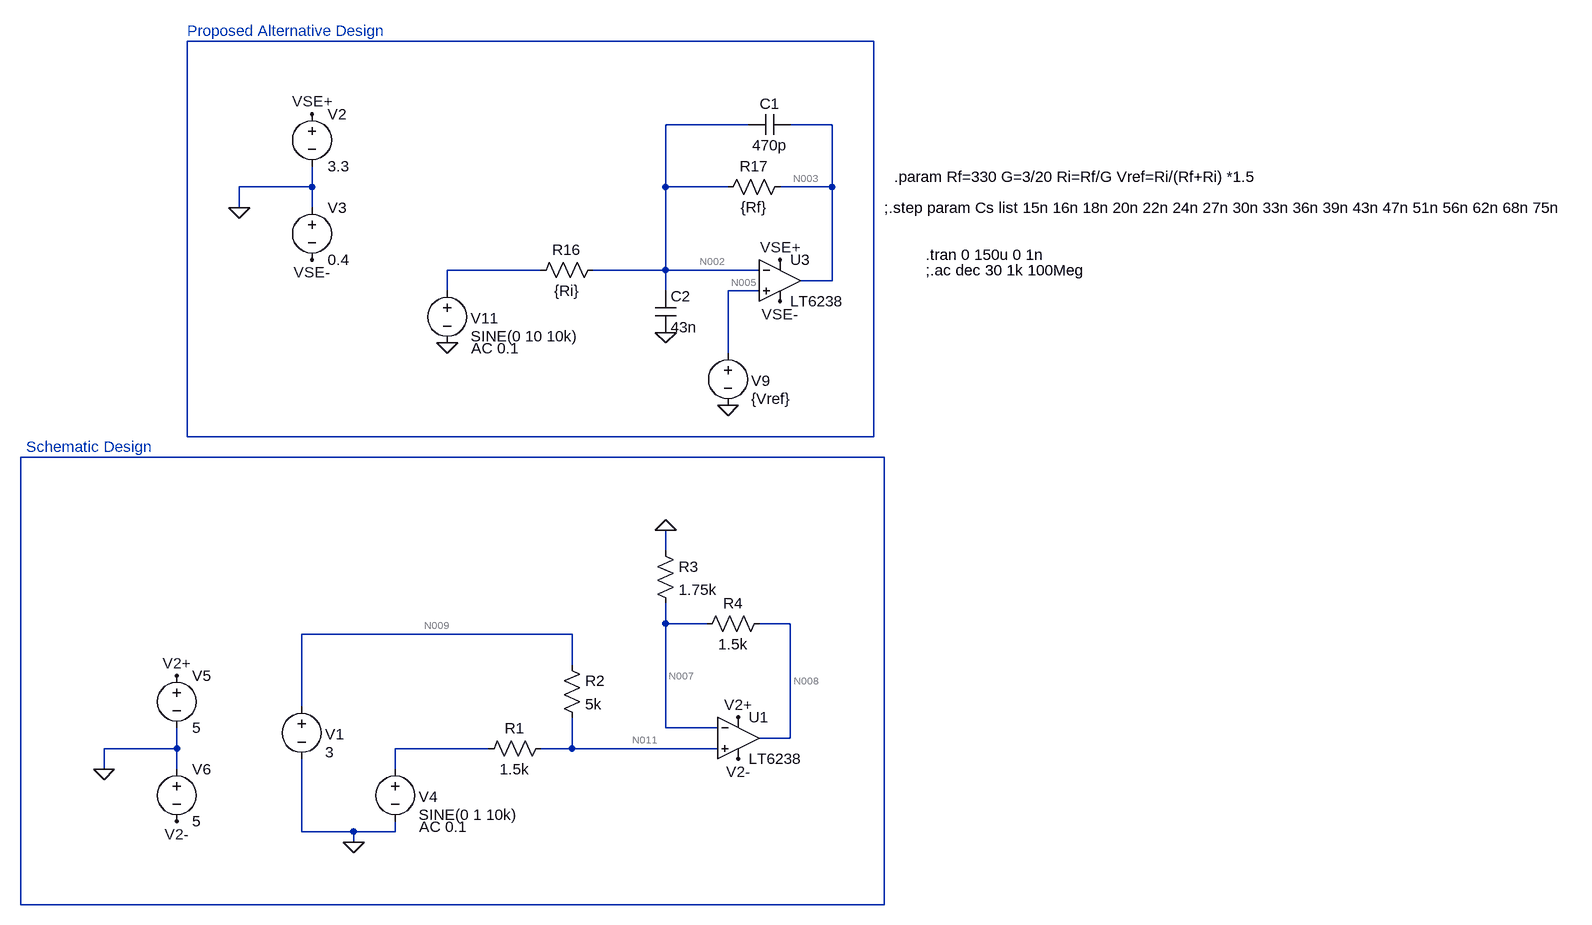
[diagram p0: schematic senior_design_attenuator_offset.asc]
* senior_design_attenuator_offset.asc
V2 VSE+ 0 3.3
V3 0 VSE- 0.4
V9 N005 0 {Vref}
* U3: LT6238 (symbol Opamps\LT6238 not available, pins judged from their places): In+=N005 In-=N002 V+=VSE+ V-=VSE- OUT=N003
R16 N002 N004 {Ri}
R17 N003 N002 {Rf}
V11 N004 0 SINE(0 10 10k) AC 0.1
C1 N003 N002 470p
C2 N002 0 43n
V1 N009 0 3
* U1: LT6238 (symbol Opamps\LT6238 not available, pins judged from their places): In+=N011 In-=N007 V+=V2+ V-=V2- OUT=N008
R1 N011 N010 1.5k
V4 N010 0 SINE(0 1 10k) AC 0.1
R2 N009 N011 5k
R3 0 N007 1.75k
R4 N008 N007 1.5k
V5 V2+ 0 5
V6 0 V2- 5
.tran 0 150u 0 1n
;.ac dec 30 1k 100Meg
.param Rf=330 G=3/20 Ri=Rf/G Vref=Ri/(Rf+Ri) *1.5
;.step param Cs list 15n 16n 18n 20n 22n 24n 27n 30n 33n 36n 39n 43n 47n 51n 56n 62n 68n 75n
* Schematic Design
* Proposed Alternative Design
.backanno
.end

* Results of the author's LTspice run, read from the files saved beside the schematic
* Operating Point, zero values left out:
*   V(vse+) = 3.3 V
*   V(vse-) = -400 mV
*   V(n005) = 1.304 V
*   V(n002) = 1.304 V
*   V(n003) = 1.502 V
*   V(n009) = 3 V
*   V(n007) = 686.5 mV
*   V(n011) = 686.5 mV
*   V(n008) = 1.282 V
*   V(v2-) = -5 V
*   V(v2+) = 5 V
*   I(R4) = 397.3 µA
*   I(R3) = -392.3 µA
*   I(R2) = 462.7 µA
*   I(R1) = 457.7 µA
*   I(R17) = 597.9 µA
*   I(R16) = 592.9 µA
*   I(V6) = -2.953 mA
*   I(V5) = -3.34 mA
*   I(V4) = 457.7 µA
*   I(V1) = -462.7 µA
*   I(V11) = 592.9 µA
*   I(V9) = -4.994 µA
*   I(V3) = -2.786 mA
*   I(V2) = -3.374 mA
*   Ix(u3:1) = 4.994 µA
*   Ix(u3:2) = 4.993 µA
*   Ix(u3:3) = -597.9 µA
*   Ix(u3:4) = 3.374 mA
*   Ix(u3:5) = -2.786 mA
*   Ix(u1:1) = 5.036 µA
*   Ix(u1:2) = 5.035 µA
*   Ix(u1:3) = -397.3 µA
*   Ix(u1:4) = 3.34 mA
*   Ix(u1:5) = -2.953 mA
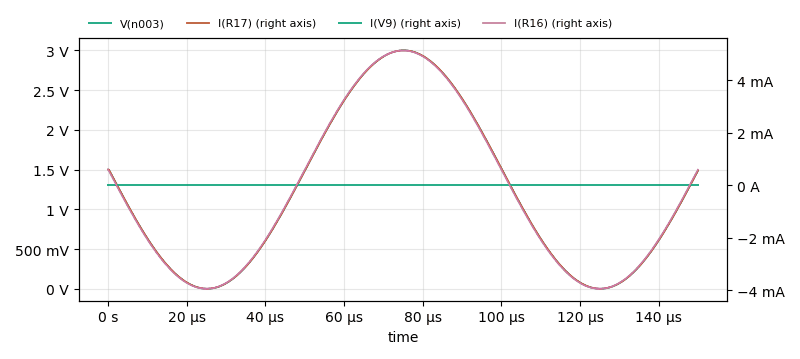
[diagram p1: Transient Analysis of senior_design_attenuator_offset.asc, plotted from the saved traces]
* Transient Analysis, 1 run:
*   V(n003): min 1.711 mV, max 3.002 V, average 1.183 V, rms 1.557 V, last 1.487 V
*   I(R17): min -3.947 mA, max 5.143 mA, average -366.5 µA, rms 3.088 mA, last 553.4 µA
*   I(V9): min -5.006 µA, max -4.982 µA, average -4.993 µA, rms 4.993 µA, last -5.005 µA
*   I(R16): min -3.953 mA, max 5.138 mA, average -371.5 µA, rms 3.089 mA, last 592.8 µA